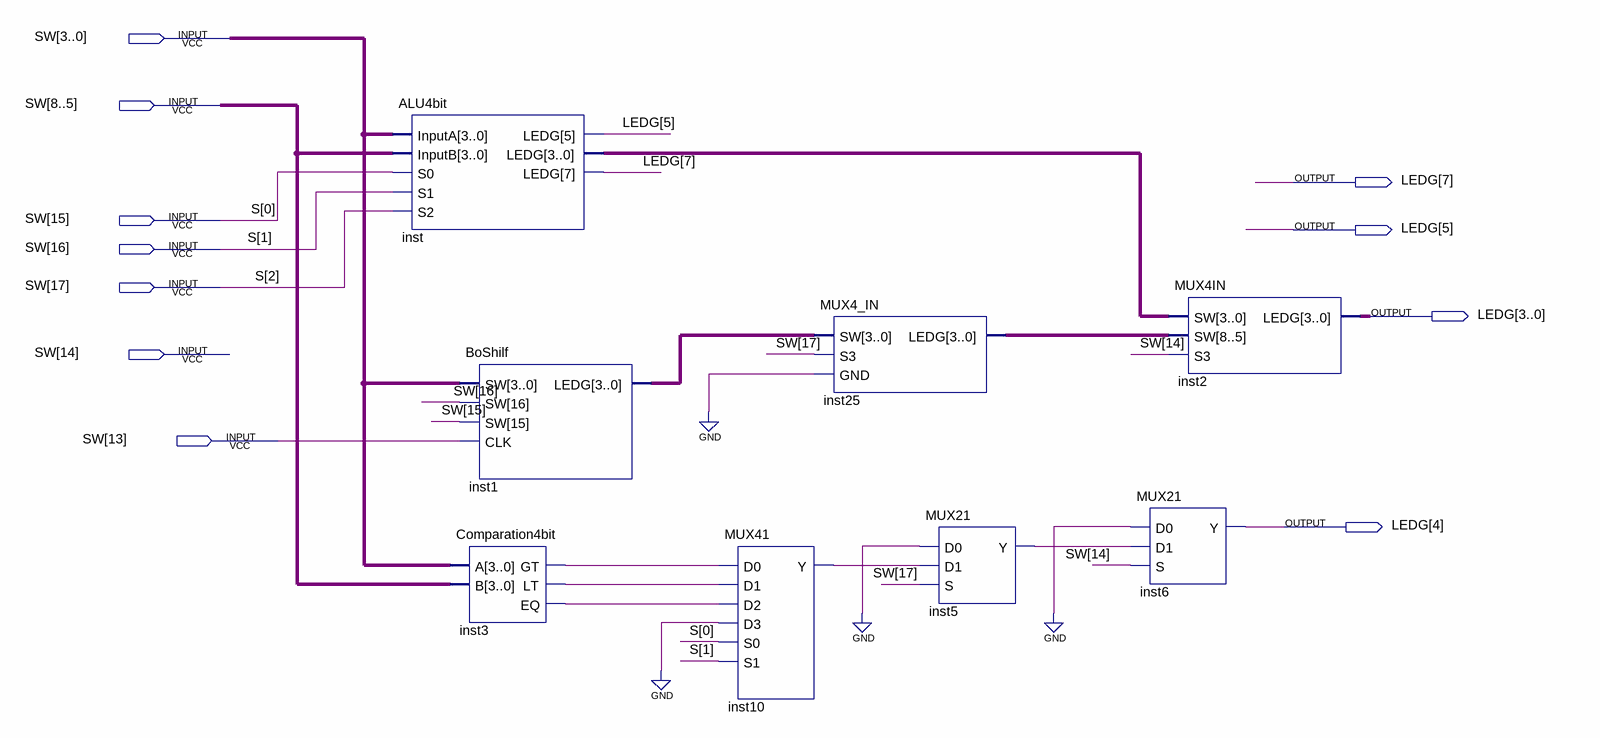
[diagram p0: schematic sheet]
// Quartus schematic ALU4bit_symbol.bdf as structural Verilog: 8 symbols, 11 pins
module ALU4bit_symbol (
  input  [17:0] SW,
  output [7:0] LEDG
);

  wire inst3_eq, inst3_gt, inst3_lt, inst5_y, inst10_y;
  wire [3:0] inst1_ledg, inst25_ledg, inst_ledg;

  ALU4bit inst (
    .InputA(SW[3:0]), .InputB(SW[8:5]), .S0(SW[15]), .S1(SW[16]), .S2(SW[17]),
    .LEDG({LEDG[7], LEDG[5], inst_ledg}));
  BoShilf inst1 (.SW({SW[16:15], SW[3:0]}), .CLK(SW[13]), .LEDG(inst1_ledg));
  Comparation4bit inst3 (.A(SW[3:0]), .B(SW[8:5]), .GT(inst3_gt), .LT(inst3_lt), .EQ(inst3_eq));
  MUX41 inst10 (.D0(inst3_gt), .D1(inst3_lt), .D2(inst3_eq), .D3(1'b0), .S0(SW[15]), .S1(SW[16]), .Y(inst10_y));
  MUX4_IN inst25 (.SW(inst1_ledg), .S3(SW[17]), .GND(1'b0), .LEDG(inst25_ledg));
  MUX21 inst5 (.D0(1'b0), .D1(inst10_y), .S(SW[17]), .Y(inst5_y));
  MUX4IN inst2 (.SW({inst25_ledg, inst_ledg}), .S3(SW[14]), .LEDG(LEDG[3:0]));
  MUX21 inst6 (.D0(1'b0), .D1(inst5_y), .S(SW[14]), .Y(LEDG[4]));

  // Other names for the same wires on the sheet: S[2:0] = SW[17:15]
endmodule
